# EAGLE design rfm12_breakout_board (EAGLE 6.4)
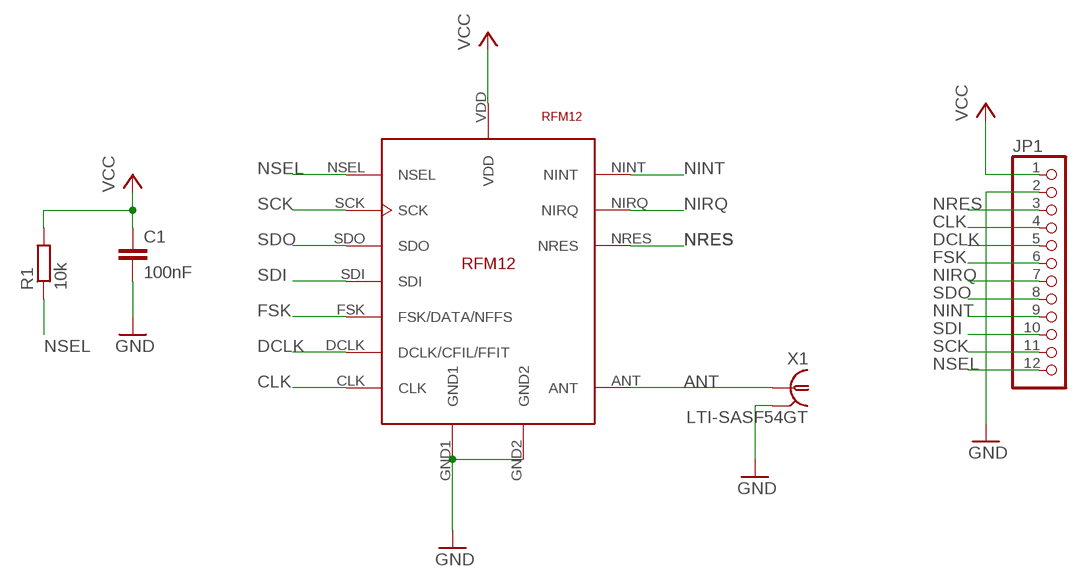
[diagram p0: schematic, sheet 1]

## Parts
C1  100nF  C-EUC0805  [C0805]
JP1  PINHD-1X12/90  [1X12/90]
R1  10k  R-EU_M0805  [M0805]
U$1  RFM12  [RFM12]
X1  LTI-SASF54GT  [LTI-SASF54GT]

## Nets
ANT: U$1.ANT X1.1
CLK: JP1.4 U$1.CLK
DCLK: JP1.5 U$1.DCLK(DCLK/CFIL/FFIT)
FSK: JP1.6 U$1.FSK(FSK/DATA/NFFS)
GND: C1.2 JP1.2 U$1.GND1 U$1.GND2 X1.2 X1.3 X1.4 X1.5
NINT: JP1.9 U$1.NINT
NIRQ: JP1.7 U$1.NIRQ
NRES: JP1.3 U$1.NRES
NSEL: JP1.12 R1.1 U$1.NSEL
SCK: JP1.11 U$1.SCK
SDI: JP1.10 U$1.SDI
SDO: JP1.8 U$1.SDO
VCC: C1.1 JP1.1 R1.2 U$1.VDD

## Library data of the parts
C1 = rcl:C-EU: CAPACITOR, European symbol
JP1 = pinhead:PINHD-1X12: PIN HEADER
R1 = rcl:R-EU_: RESISTOR, European symbol
U$1 = kaibader:RFM12: The RFM12 is an ISM band FSK transceiver module. It operates in the 434 MHz band and fully complies with FCC and ETSI regulations.
X1 = con-coax:LTI-SASF54GT: SMA vertical PCB thrue hole jack Source: Lighthorse Technologies, inc. SASF54GT.pdf; OC_FARNELL: unknown; OC_NEWARK: unknown

## Board
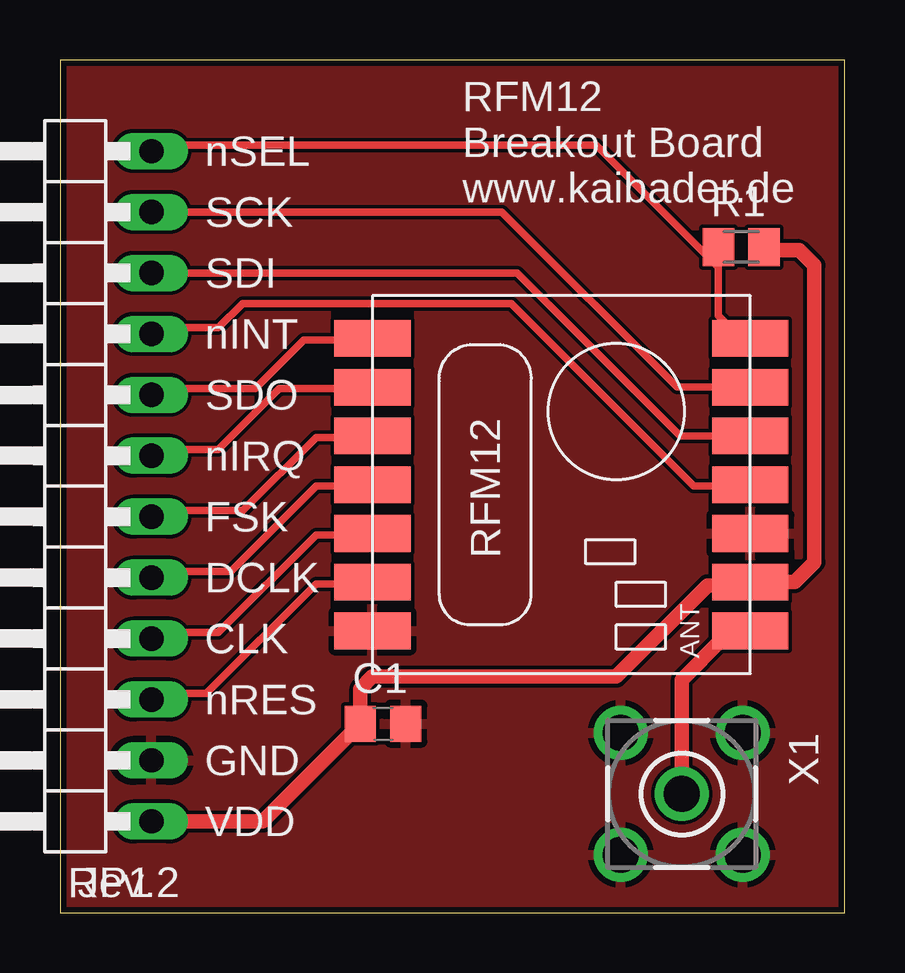
[diagram p1: board, top side]
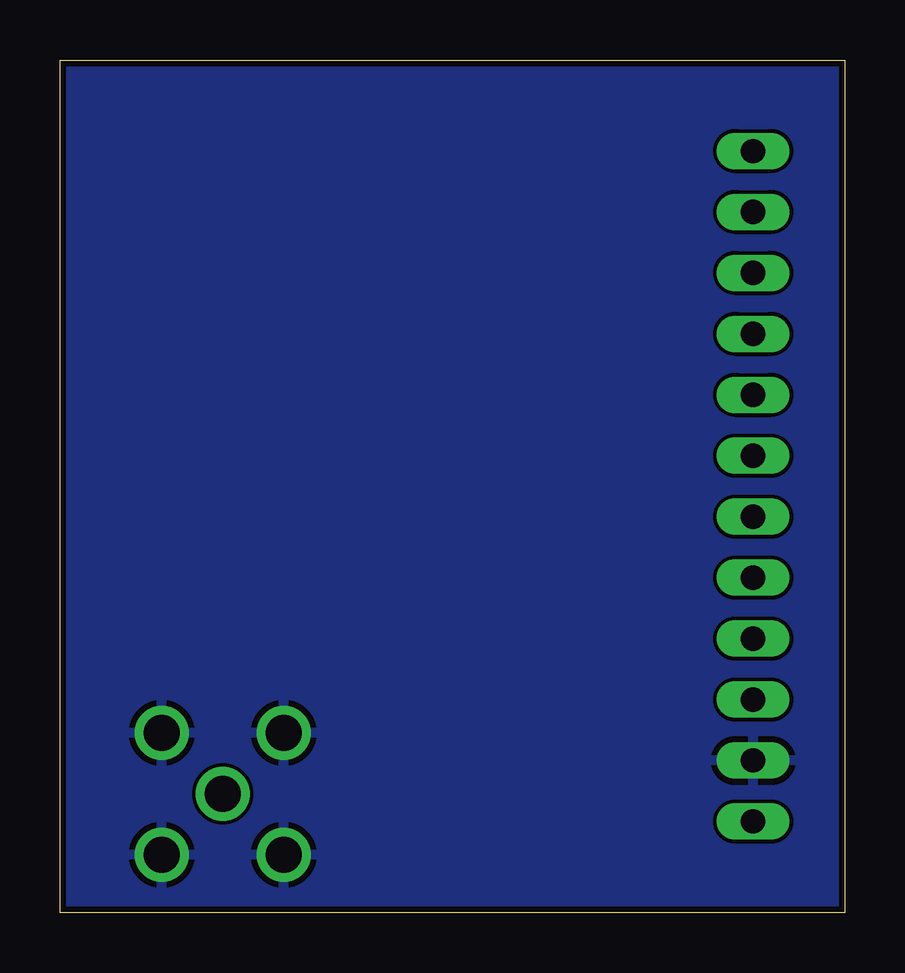
[diagram p2: board, bottom side, seen from below]

Size 32.69 x 35.55 mm. Coordinates in mm from the lower left corner, seen from the top.
Outline: 0,0 32.69,0 32.69,35.55 0,35.55 0,0
Copper layers (1*16): Top 0.035mm / dielectric 1.5mm / Bottom 0.035mm
Design rules "ITEADstudio_DRC": minimum track width 6mil, minimum drill 12mil, track to track 6mil, track to pad 6mil, pad to pad 6mil, via to via 6mil, smd to smd 0mil, copper to edge 10mil, drill to drill 10mil, minimum pad ring 10mil, minimum via ring 6mil, stop-mask expansion 2mil, vias tented up to drill 100mil, thermal gap 10mil

### Footprints (pad centres in the part's own frame; a part is rotated, then mirrored left to right if it is on the bottom)
C0805 = smd 1.3 x 1.5: 1 -0.95,0; 2 0.95,0
1X12/90 = drill 1.016 long: 1 -13.97,-3.81; 2 -11.43,-3.81; 3 -8.89,-3.81; 4 -6.35,-3.81; 5 -3.81,-3.81; 6 -1.27,-3.81; 7 1.27,-3.81; 8 3.81,-3.81; 9 6.35,-3.81; 10 8.89,-3.81; 11 11.43,-3.81; 12 13.97,-3.81
M0805 = smd 1.3 x 1.6: 1 -0.95,0; 2 0.95,0
RFM12 = smd 1.524 x 3.175: ANT 13.97,15.748; CLK 9.906,0; DCLK 7.874,0; FSK 5.842,0; GND1 9.906,15.748; GND2 13.97,0; NINT 7.874,15.748; NIRQ 3.81,0; NRES 11.938,0; NSEL 1.778,15.748; SCK 3.81,15.748; SDI 5.842,15.748; SDO 1.778,0; VDD 11.938,15.748
LTI-SASF54GT = drill 1.5 pad 2.2: 1 0,0; 2 -2.54,2.54; 3 2.54,2.54; 4 2.54,-2.54; 5 -2.54,-2.54

### Placement (x,y rotation side)
C1  13.46,7.87 0 top
JP1  0,17.78 90 top
R1  28.38,27.75 0 top
U$1  13.02,25.72 270 top
X1  25.91,4.95 270 top

### Tracks (layer width: path | path; a pad name or v marks a point on that pad's centre or on a via)
ANT
  Top 0.61: X1.1 25.91,9.72 27.62,11.43
  Top 0.813: 27.62,11.43 28.45,11.43 U$1.ANT
CLK
  Top 0.305: JP1.4 4.06,11.68 6.6,11.68 10.67,15.75 12.7,15.75 U$1.CLK
DCLK
  Top 0.305: JP1.5 4.06,14.22 7.11,14.22 10.67,17.78 12.7,17.78 U$1.DCLK
FSK
  Top 0.305: JP1.6 4.06,16.76 7.62,16.76 10.67,19.81 12.7,19.81 U$1.FSK
GND
  pour Bottom: 0,35.56 33.02,35.56 33.02,0 0,0
  pour Top: 0,35.56 33.02,35.56 33.02,0 0,0
NINT
  Top 0.305: JP1.9 4.06,24.38 6.6,24.38 7.62,25.4 18.8,25.4 26.42,17.78 28.45,17.78 U$1.NINT
NIRQ
  Top 0.305: JP1.7 4.06,19.3 6.6,19.3 9.14,21.84 12.7,21.84 U$1.NIRQ
NRES
  Top 0.305: JP1.3 4.06,9.14 6.1,9.14 10.67,13.72 12.7,13.72 U$1.NRES
NSEL
  Top 0.305: 27.43,26.92 27.43,24.89 28.45,23.88 U$1.NSEL | 27.43,26.92 27.43,27.43 R1.1 | 27.43,26.92 22.35,32 4.06,32 JP1.12
SCK
  Top 0.305: U$1.SCK 25.72,21.91 18.41,29.21 JP1.11
SDI
  Top 0.305: U$1.SDI 25.84,19.88 19.05,26.67 JP1.10
SDO
  Top 0.305: JP1.8 4.06,21.84 8.13,21.84 10.16,23.88 12.7,23.88 U$1.SDO
VCC
  Top 0.61: JP1.1 8.45,3.81 C1.1 12.51,9.34 13.02,9.84 23.18,9.84 26.99,13.65 28.64,13.65 | U$1.VDD 30.61,13.78 31.43,14.61 31.43,26.99 30.8,27.62 29.46,27.62
  Top 0.813: 28.64,13.65 U$1.VDD | 29.46,27.62 R1.2

### Text on the board
tPlace: nSEL | RFM12 / Breakout Board / www.kaibader.de | SCK | SDI | nINT | SDO | nIRQ | FSK | DCLK | CLK | nRES | GND | VDD | Rev.2